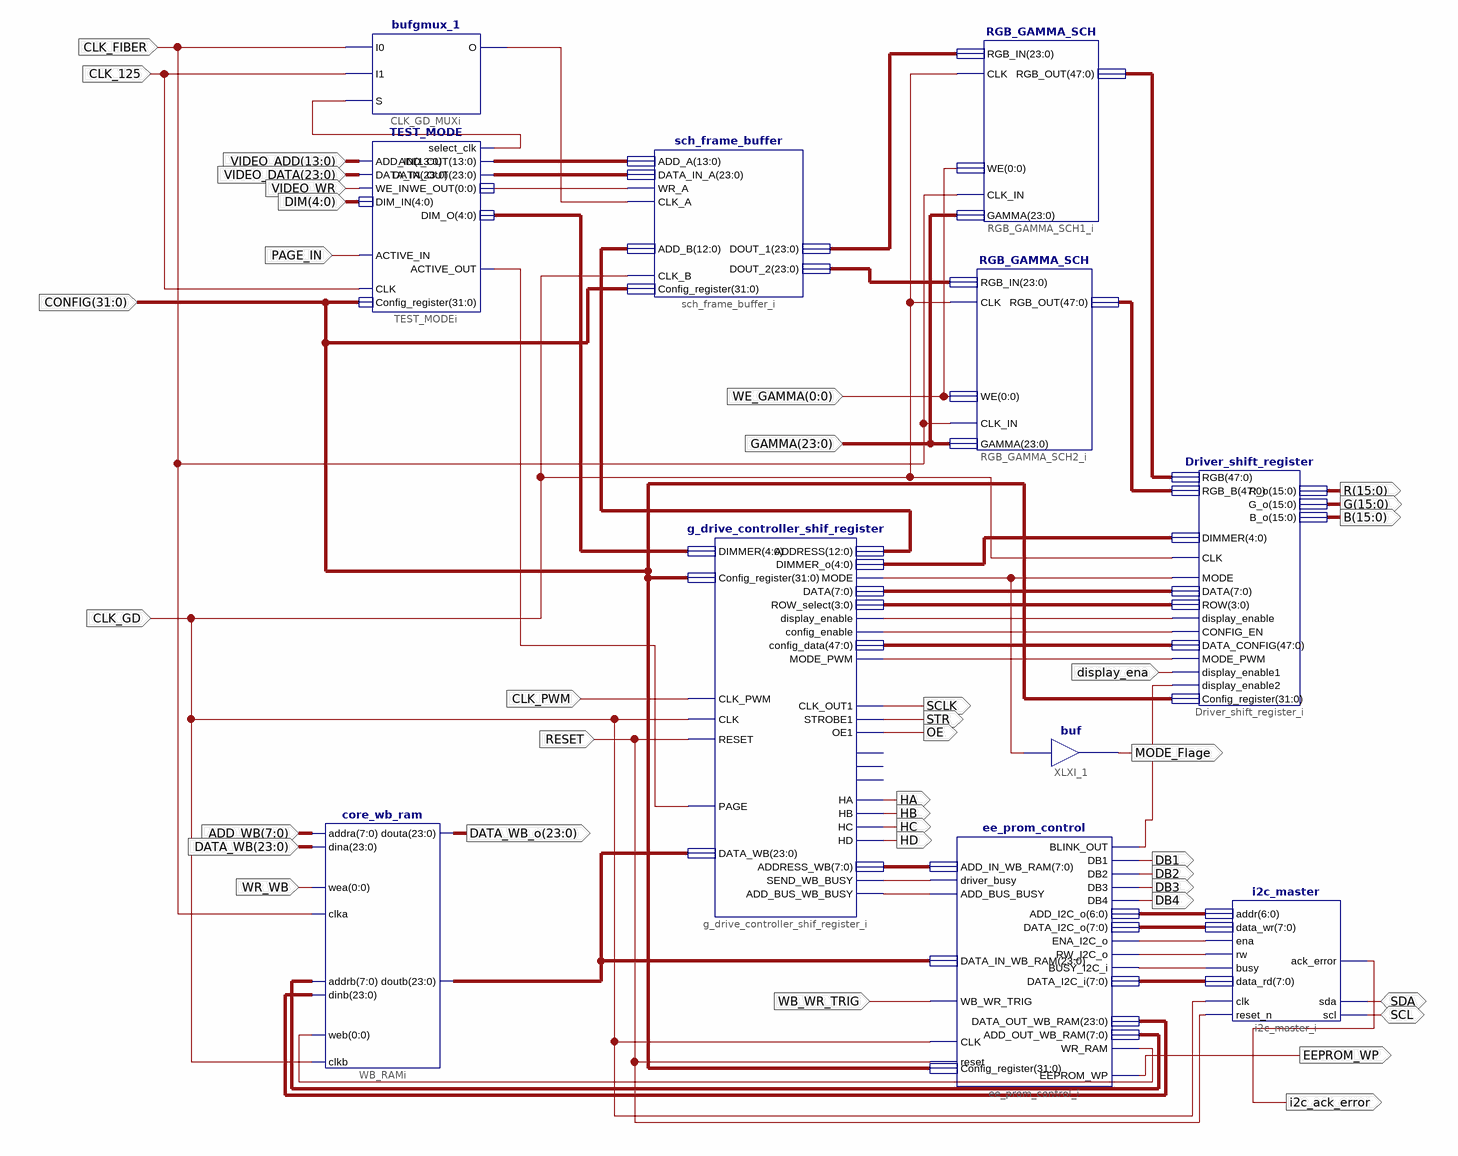
[diagram p0: schematic sheet 1]
// Xilinx ISE schematic GD_Drive.sch (spartan6) as structural Verilog: 11 symbols, 38 ports
module GD_Drive (
  input  RESET,
  input  CLK_FIBER,
  input  [13:0] VIDEO_ADD,
  input  [23:0] VIDEO_DATA,
  input  VIDEO_WR,
  input  [0:0] WE_GAMMA,
  input  [23:0] GAMMA,
  input  CLK_GD,
  input  [4:0] DIM,
  input  PAGE_IN,
  input  CLK_125,
  input  [7:0] ADD_WB,
  input  [23:0] DATA_WB,
  input  WR_WB,
  input  [31:0] CONFIG,
  input  WB_WR_TRIG,
  input  CLK_PWM,
  input  display_ena,
  inout  SDA,
  inout  SCL,
  output SCLK,
  output STR,
  output OE,
  output [23:0] DATA_WB_o,
  output HA,
  output HB,
  output HC,
  output HD,
  output DB1,
  output DB2,
  output DB3,
  output DB4,
  output EEPROM_WP,
  output i2c_ack_error,
  output [15:0] R,
  output [15:0] G,
  output [15:0] B,
  output MODE_Flage
);

  wire XLXN_187, XLXN_188, XLXN_425, XLXN_487, XLXN_488, XLXN_887, XLXN_888, XLXN_900, XLXN_901, XLXN_1008,
       XLXN_1021, XLXN_1022, XLXN_1025;
  wire [0:0] XLXN_893, XLXN_1017;
  wire [3:0] XLXN_186;
  wire [4:0] XLXN_1023, XLXN_1024;
  wire [6:0] XLXN_885;
  wire [7:0] XLXN_185, XLXN_886, XLXN_890, XLXN_892, XLXN_899;
  wire [12:0] XLXN_6;
  wire [13:0] XLXN_1;
  wire [23:0] XLXN_2, XLXN_4, XLXN_876, XLXN_891, XLXN_1018;
  wire [47:0] XLXN_422, XLXN_426, XLXN_1016;

  RGB_GAMMA_SCH RGB_GAMMA_SCH2_i (
    .WE(WE_GAMMA[0]), .CLK_IN(CLK_FIBER), .CLK(CLK_GD), .GAMMA(GAMMA), .RGB_IN(XLXN_4), .RGB_OUT(XLXN_422));
  bufgmux_1 CLK_GD_MUXi (.I0(CLK_FIBER), .I1(CLK_125), .S(XLXN_488), .O(XLXN_487));
  TEST_MODE TEST_MODEi (
    .WE_IN(VIDEO_WR), .CLK(CLK_125), .DATA_IN(VIDEO_DATA), .ADD_IN(VIDEO_ADD), .Config_register(CONFIG),
    .DATA_OUT(XLXN_2), .ADD_OUT(XLXN_1), .WE_OUT(XLXN_1017[0]), .DIM_IN(DIM), .ACTIVE_IN(PAGE_IN),
    .ACTIVE_OUT(XLXN_425), .select_clk(XLXN_488), .DIM_O(XLXN_1024));
  ee_prom_control ee_prom_control_i (
    .BUSY_I2C_i(XLXN_1008), .CLK(CLK_GD), .driver_busy(XLXN_900), .reset(RESET), .WB_WR_TRIG(WB_WR_TRIG),
    .DATA_IN_WB_RAM(XLXN_876), .ADD_IN_WB_RAM(XLXN_899), .DATA_I2C_i(XLXN_890), .Config_register(CONFIG),
    .WR_RAM(XLXN_893[0]), .ENA_I2C_o(XLXN_887), .RW_I2C_o(XLXN_888), .ADD_BUS_BUSY(XLXN_901), .DB1(DB1),
    .DB2(DB2), .DB3(DB3), .DB4(DB4), .EEPROM_WP(EEPROM_WP), .DATA_OUT_WB_RAM(XLXN_891),
    .ADD_OUT_WB_RAM(XLXN_892), .ADD_I2C_o(XLXN_885), .DATA_I2C_o(XLXN_886), .BLINK_OUT(XLXN_1022));
  i2c_master i2c_master_i (
    .data_wr(XLXN_886), .addr(XLXN_885), .ack_error(i2c_ack_error), .scl(SCL), .reset_n(RESET), .clk(CLK_GD),
    .sda(SDA), .ena(XLXN_887), .rw(XLXN_888), .data_rd(XLXN_890), .busy(XLXN_1008));
  g_drive_controller_shif_register g_drive_controller_shif_register_i (
    .CLK(CLK_GD), .CLK_PWM(CLK_PWM), .RESET(RESET), .PAGE(XLXN_425), .ADD_BUS_WB_BUSY(XLXN_901),
    .DATA_WB(XLXN_876), .DIMMER(XLXN_1024), .display_enable(XLXN_187), .config_enable(XLXN_188),
    .MODE(XLXN_1025), .MODE_PWM(XLXN_1021), .SEND_WB_BUSY(XLXN_900), .STROBE1(STR), .OE1(OE),
    .CLK_OUT1(SCLK), .HA(HA), .HB(HB), .HC(HC), .HD(HD), .ADDRESS(XLXN_6), .DATA(XLXN_185),
    .ADDRESS_WB(XLXN_899), .ROW_select(XLXN_186), .config_data(XLXN_426), .DIMMER_o(XLXN_1023),
    .Config_register(CONFIG));  // open: STROBE2, OE2, CLK_OUT2
  Driver_shift_register Driver_shift_register_i (
    .CLK(CLK_GD), .MODE(XLXN_1025), .MODE_PWM(XLXN_1021), .CONFIG_EN(XLXN_188), .display_enable(XLXN_187),
    .display_enable1(display_ena), .display_enable2(XLXN_1022), .RGB(XLXN_1016), .RGB_B(XLXN_422),
    .DATA(XLXN_185), .ROW(XLXN_186), .DIMMER(XLXN_1023), .DATA_CONFIG(XLXN_426), .R_o(R), .G_o(G), .B_o(B),
    .Config_register(CONFIG));
  RGB_GAMMA_SCH RGB_GAMMA_SCH1_i (
    .WE(WE_GAMMA[0]), .CLK_IN(CLK_FIBER), .CLK(CLK_GD), .GAMMA(GAMMA), .RGB_IN(XLXN_1018), .RGB_OUT(XLXN_1016));
  sch_frame_buffer sch_frame_buffer_i (
    .DATA_IN_A(XLXN_2), .CLK_A(XLXN_487), .ADD_B(XLXN_6), .CLK_B(CLK_GD), .WR_A(XLXN_1017[0]),
    .ADD_A(XLXN_1), .DOUT_1(XLXN_1018), .DOUT_2(XLXN_4), .Config_register(CONFIG));
  core_wb_ram WB_RAMi (
    .addra(ADD_WB), .dina(DATA_WB), .wea(WR_WB), .clka(CLK_FIBER), .addrb(XLXN_892), .dinb(XLXN_891),
    .web(XLXN_893[0]), .clkb(CLK_GD), .doutb(XLXN_876), .douta(DATA_WB_o));
  buf XLXI_1 (MODE_Flage, XLXN_1025);
endmodule
